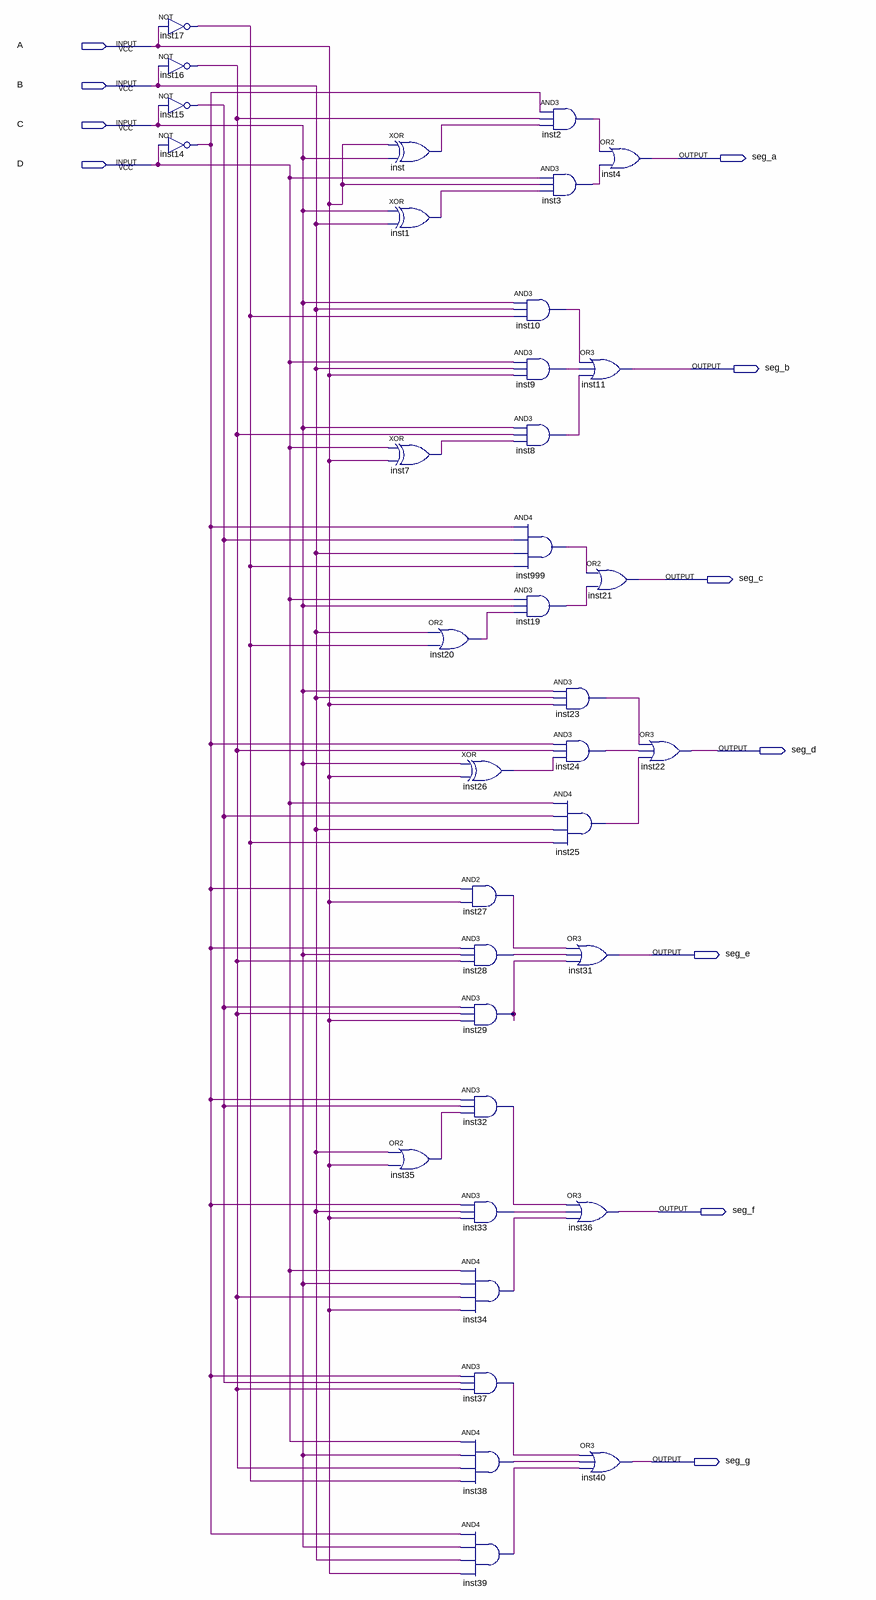
[diagram p0: schematic sheet]
// Quartus schematic encoder_display.bdf as structural Verilog: 36 symbols, 11 pins
module encoder_display (
  input  A,
  input  B,
  input  C,
  input  D,
  output seg_a,
  output seg_b,
  output seg_c,
  output seg_d,
  output seg_e,
  output seg_f,
  output seg_g
);

  wire inst1_out, inst2_out, inst3_out, inst7_out, inst8_out, inst9_out, inst10_out, inst14_out, inst15_out,
       inst16_out, inst17_out, inst19_out, inst20_out, inst23_out, inst24_out, inst25_out, inst26_out,
       inst27_out, inst28_out, inst29_out, inst32_out, inst33_out, inst34_out, inst35_out, inst37_out,
       inst38_out, inst39_out, inst999_out, inst_out;

  not inst17 (inst17_out, A);
  not inst16 (inst16_out, B);
  not inst15 (inst15_out, C);
  not inst14 (inst14_out, D);
  xor inst (inst_out, A, C);
  xor inst1 (inst1_out, C, B);
  xor inst7 (inst7_out, D, A);
  or inst20 (inst20_out, B, inst17_out);
  or inst35 (inst35_out, B, A);
  xor inst26 (inst26_out, C, A);
  and inst27 (inst27_out, inst14_out, A);
  and inst28 (inst28_out, inst14_out, C, inst16_out);
  and inst29 (inst29_out, inst15_out, inst16_out, A);
  and inst32 (inst32_out, inst14_out, inst15_out, inst35_out);
  and inst33 (inst33_out, inst14_out, B, A);
  and inst34 (inst34_out, D, C, inst16_out, A);
  and inst37 (inst37_out, inst14_out, inst15_out, inst16_out);
  and inst38 (inst38_out, D, C, inst16_out, inst17_out);
  and inst39 (inst39_out, inst14_out, C, B, A);
  and inst2 (inst2_out, inst14_out, inst16_out, inst_out);
  and inst3 (inst3_out, D, A, inst1_out);
  and inst10 (inst10_out, C, B, inst17_out);
  and inst9 (inst9_out, D, B, A);
  and inst8 (inst8_out, C, inst16_out, inst7_out);
  and inst999 (inst999_out, inst14_out, inst15_out, B, inst17_out);
  and inst19 (inst19_out, D, C, inst20_out);
  or inst11 (seg_b, inst10_out, inst9_out, inst8_out);
  or inst21 (seg_c, inst999_out, inst19_out);
  and inst23 (inst23_out, C, B, A);
  and inst24 (inst24_out, inst14_out, inst16_out, inst26_out);
  and inst25 (inst25_out, D, inst15_out, B, inst17_out);
  or inst31 (seg_e, inst27_out, inst28_out, inst29_out);
  or inst36 (seg_f, inst32_out, inst33_out, inst34_out);
  or inst40 (seg_g, inst37_out, inst38_out, inst39_out);
  or inst4 (seg_a, inst2_out, inst3_out);
  or inst22 (seg_d, inst23_out, inst24_out, inst25_out);
endmodule
